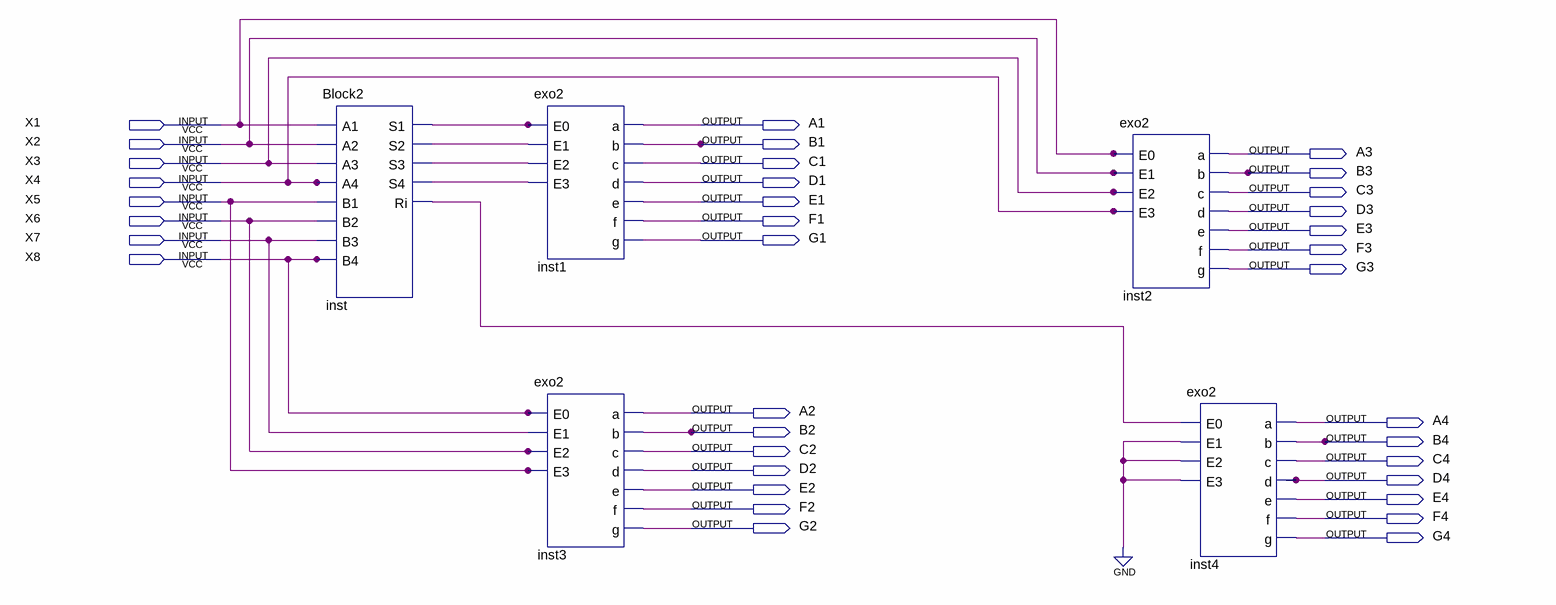
[diagram p0: schematic sheet]
// Quartus schematic Blockdecodeur.bdf as structural Verilog: 5 symbols, 36 pins
module Blockdecodeur (
  input  X1,
  input  X2,
  input  X3,
  input  X4,
  input  X5,
  input  X6,
  input  X7,
  input  X8,
  output A1,
  output B1,
  output A3,
  output C1,
  output B3,
  output D1,
  output C3,
  output E1,
  output D3,
  output F1,
  output E3,
  output G1,
  output F3,
  output G3,
  output A2,
  output A4,
  output B2,
  output B4,
  output C2,
  output C4,
  output D2,
  output D4,
  output E2,
  output E4,
  output F2,
  output F4,
  output G2,
  output G4
);

  wire inst_ri, inst_s1, inst_s2, inst_s3, inst_s4;

  Block2 inst (
    .A1(X1), .A2(X2), .A3(X3), .A4(X4), .B1(X5), .B2(X6), .B3(X7), .B4(X8), .S1(inst_s1), .S2(inst_s2),
    .S3(inst_s3), .S4(inst_s4), .Ri(inst_ri));
  exo2 inst1 (
    .E0(inst_s1), .E1(inst_s2), .E2(inst_s3), .E3(inst_s4), .a(A1), .b(B1), .c(C1), .d(D1), .e(E1), .f(F1),
    .g(G1));
  exo2 inst3 (.E0(X8), .E1(X7), .E2(X6), .E3(X5), .a(A2), .b(B2), .c(C2), .d(D2), .e(E2), .f(F2), .g(G2));
  exo2 inst2 (.E0(X1), .E1(X2), .E2(X3), .E3(X4), .a(A3), .b(B3), .c(C3), .d(D3), .e(E3), .f(F3), .g(G3));
  exo2 inst4 (.E0(inst_ri), .E1(1'b0), .E2(1'b0), .E3(1'b0), .a(A4), .b(B4), .c(C4), .d(D4), .e(E4), .f(F4), .g(G4));
endmodule
